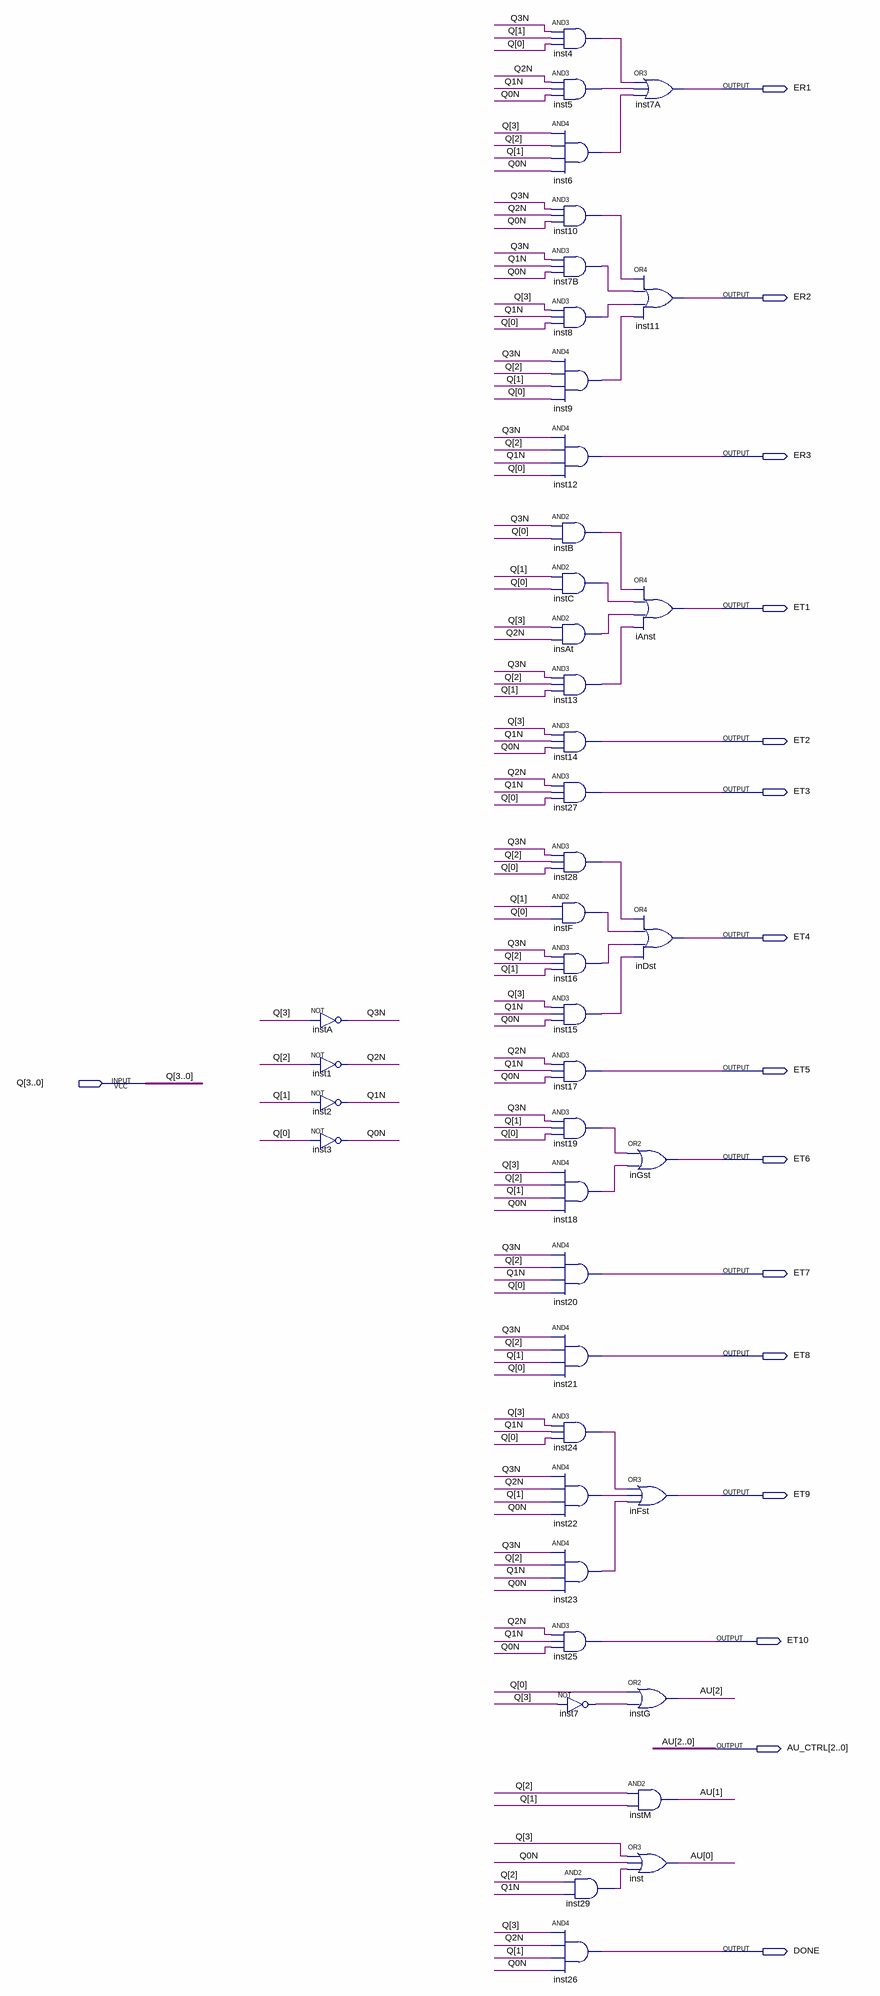
[diagram p0: schematic sheet]
// Quartus schematic OUTPUT.bdf as structural Verilog: 43 symbols, 16 pins
module OUTPUT (
  input  [3:0] Q,
  output ER1,
  output ER2,
  output ER3,
  output ET1,
  output ET2,
  output ET3,
  output ET4,
  output ET5,
  output ET6,
  output ET7,
  output ET8,
  output ET9,
  output ET10,
  output [2:0] AU_CTRL,
  output DONE
);

  wire insAt_out, inst4_out, inst5_out, inst6_out, inst7_out, inst7B_out, inst8_out, inst9_out, inst10_out,
       inst13_out, inst15_out, inst16_out, inst18_out, inst19_out, inst22_out, inst23_out, inst24_out,
       inst28_out, inst29_out, instB_out, instC_out, instF_out, Q0N, Q1N, Q2N, Q3N;

  not instA (Q3N, Q[3]);
  not inst1 (Q2N, Q[2]);
  not inst2 (Q1N, Q[1]);
  not inst3 (Q0N, Q[0]);
  and inst4 (inst4_out, Q3N, Q[1], Q[0]);
  and inst5 (inst5_out, Q2N, Q1N, Q0N);
  and inst6 (inst6_out, Q[3], Q[2], Q[1], Q0N);
  and inst10 (inst10_out, Q3N, Q2N, Q0N);
  and inst7B (inst7B_out, Q3N, Q1N, Q0N);
  and inst8 (inst8_out, Q[3], Q1N, Q[0]);
  and inst9 (inst9_out, Q3N, Q[2], Q[1], Q[0]);
  and inst12 (ER3, Q3N, Q[2], Q1N, Q[0]);
  and instB (instB_out, Q3N, Q[0]);
  and instC (instC_out, Q[1], Q[0]);
  and insAt (insAt_out, Q[3], Q2N);
  and inst13 (inst13_out, Q3N, Q[2], Q[1]);
  and inst14 (ET2, Q[3], Q1N, Q0N);
  and inst27 (ET3, Q2N, Q1N, Q[0]);
  and inst28 (inst28_out, Q3N, Q[2], Q[0]);
  and instF (instF_out, Q[1], Q[0]);
  and inst16 (inst16_out, Q3N, Q[2], Q[1]);
  and inst15 (inst15_out, Q[3], Q1N, Q0N);
  and inst17 (ET5, Q2N, Q1N, Q0N);
  and inst19 (inst19_out, Q3N, Q[1], Q[0]);
  and inst18 (inst18_out, Q[3], Q[2], Q[1], Q0N);
  and inst20 (ET7, Q3N, Q[2], Q1N, Q[0]);
  and inst21 (ET8, Q3N, Q[2], Q[1], Q[0]);
  and inst24 (inst24_out, Q[3], Q1N, Q[0]);
  and inst22 (inst22_out, Q3N, Q2N, Q[1], Q0N);
  and inst23 (inst23_out, Q3N, Q[2], Q1N, Q0N);
  and inst25 (ET10, Q2N, Q1N, Q0N);
  not inst7 (inst7_out, Q[3]);
  and inst29 (inst29_out, Q[2], Q1N);
  and inst26 (DONE, Q[3], Q2N, Q[1], Q0N);
  or inst7A (ER1, inst4_out, inst5_out, inst6_out);
  or inst11 (ER2, inst10_out, inst7B_out, inst8_out, inst9_out);
  or iAnst (ET1, instB_out, instC_out, insAt_out, inst13_out);
  or inDst (ET4, inst28_out, instF_out, inst16_out, inst15_out);
  or inGst (ET6, inst19_out, inst18_out);
  or inFst (ET9, inst24_out, inst22_out, inst23_out);
  or instG (AU_CTRL[2], Q[0], inst7_out);
  and instM (AU_CTRL[1], Q[2], Q[1]);
  or inst (AU_CTRL[0], Q[3], Q0N, inst29_out);

  // Other names for the same wires on the sheet: AU[2:0] = AU_CTRL
endmodule
